# Altium project 非自锁降压电源模块（LMR12006）.PrjPcb
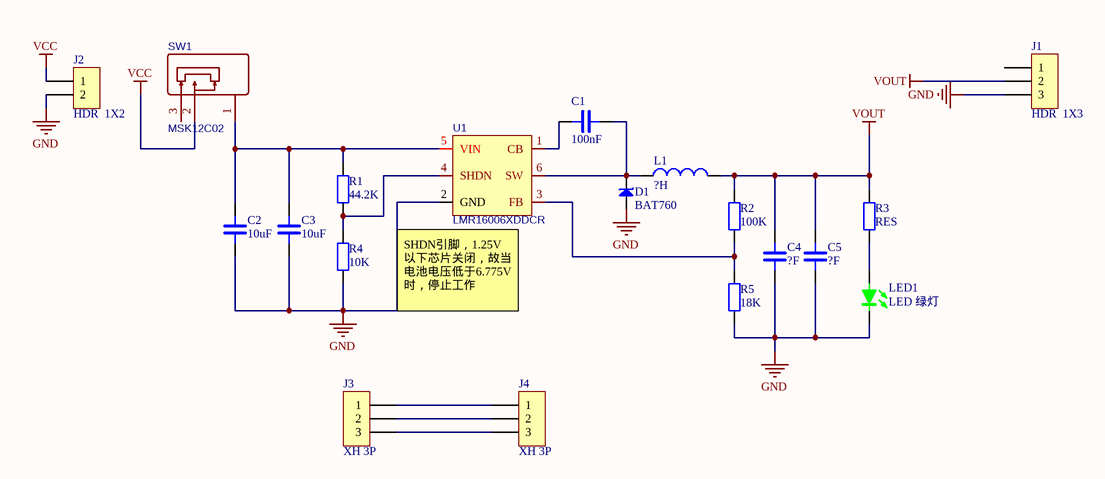
[diagram p0: LMR12006.SchDoc]
1 sheet, 19 parts. Net scope: global (net labels, ports and power ports of the same name join across sheets).
Board files: 非自锁降压电源模块.PcbDoc, 非自锁降压电源模块（拼夕夕）.PcbDoc

## Sheet LMR12006.SchDoc
size A4; SheetNumber: 1; SheetTotal: 1

### Parts
C1  100nF  [C 0603]
C2  10uF  [C 1206]
C3  10uF  [C 1206]
C4  ?F  [C 1206]
C5  ?F  [C 1206]
D1  BAT760  [SOD-323]
J1  HDR  1X3  [HDR2.54 D-L-F-1X3P]
J2  HDR  1X2  [HDR2.54 D-L-F-1X2P]
J3  XH 3P  [XH2.54-3P]
J4  XH 3P  [XH2.54-3P]
L1  ?H  [SMD 7*7*4]
LED1  LED 绿灯  [LED 0603-G]
R1  44.2K  [R 0603]
R2  100K  [R 0603]
R3  RES  [R 0603]
R4  10K  [R 0603]
R5  18K  [R 0603]
SW1  MSK12C02  [*SW-TH_MSK12C02]
U1  LMR16006XDDCR  [SOT23-6]

### Nets
GND: C2.2 C3.2 C4.1 C5.1 D1.1(A) J1.3 J2.2 LED1.2(C) R4.1 R5.1 U1.2(GND)
VCC: J2.1 SW1.2
VOUT: C4.2 C5.2 J1.2 L1.2 R2.2 R3.2
NetC1_1: C1.1 U1.1(CB)
NetC1_2: C1.2 D1.2(K) L1.1 U1.6(SW)
NetC2_1: C2.1 C3.1 R1.2 SW1.1 U1.5(VIN)
NetJ3_1: J3.1 J4.1
NetJ3_2: J3.2 J4.2
NetJ3_3: J3.3 J4.3
NetLED1_1: LED1.1(A) R3.1
NetR1_1: R1.1 R4.2 U1.4(SHDN)
NetR2_1: R2.1 R5.2 U1.3(FB)

Not connected (* = marked no-connect by the designer): J1 1; SW1 3

### Notes on the sheet
- (near U1) SHDN引脚，1.25V以下芯片关闭，故当电池电压低于6.775V时，停止工作

### Library data of the parts
C1-C5 = CAP: Capacitor
D1 = BAT760: 肖特基二极管
J1 = HDR  1X3: Connector
J2 = HDR  1X2: Connector
J3 J4 = XH 3P: Connector
L1 = Inductor: Code_IEC: 1005; Published: 8-Jun-2000; LatestRevisionDate: 17-Jul-2002; LatestRevisionNote: Re-released for DXP Platform.; PackageReference: 0402-A; Publisher: Altium Limited; Code_JEITA: 0402
LED1 = LED 绿灯: LED
R1-R5 = RES: Resistor
SW1 = MSK12C02: 开关; BOM_Manufacturer: SHOU HAN; Contributor: LCSC; BOM_Supplier: LCSC; BOM_Supplier Part: C431540; BOM_Manufacturer Part: MSK12C02; BOM_JLCPCB Part Class: Extended Part; spicePre: S; spiceSymbolName: MSK12C02
U1 = LMR16006XDDCR: DC-DC降压模块; BOM_Manufacturer: TI; BOM_Supplier: LCSC; BOM_Manufacturer Part: LMR16006XDDCR; BOM_Supplier Part: C87080; BOM_JLCPCB Part Class: Extended Part; spicePre: U; spiceSymbolName: LMR16006XDDCR